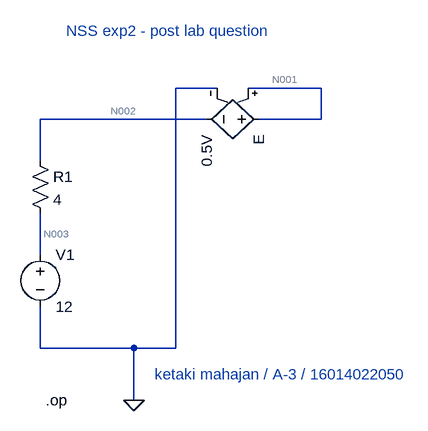
[diagram p0: schematic exp2_plq_16014022050.asc]
exp2_plq_16014022050.asc, the LTspice schematic file:
Version 4
SHEET 1 880 680
WIRE 336 -48 272 -48
WIRE 496 -48 384 -48
WIRE 320 0 64 0
WIRE 496 0 496 -48
WIRE 496 0 400 0
WIRE 64 64 64 0
WIRE 64 208 64 144
WIRE 64 352 64 288
WIRE 208 352 64 352
WIRE 272 352 272 -48
WIRE 272 352 208 352
WIRE 208 432 208 352
FLAG 208 432 0
SYMBOL res 48 48 R0
SYMATTR InstName R1
SYMATTR Value 4
SYMBOL voltage 64 192 R0
SYMATTR InstName V1
SYMATTR Value 12
SYMBOL e 416 0 R90
SYMATTR InstName E
SYMATTR Value 0.5V
TEXT 240 392 Left 2 ;ketaki mahajan / A-3 / 16014022050
TEXT 104 -136 Left 2 ;NSS exp2 - post lab question
TEXT 72 432 Left 2 !.op

The netlist it stands for:
* exp2_plq_16014022050.asc
R1 N002 N003 4
V1 N003 0 12
E N001 N002 N001 0 0.5V
* ketaki mahajan / A-3 / 16014022050
* NSS exp2 - post lab question
.op
.backanno
.end

* Results of the author's LTspice run, read from the files saved beside the schematic
* Operating Point:
*   V(n002) = 12 V
*   V(n003) = 12 V
*   V(n001) = 24 V
*   I(R1) = 0 A
*   I(E) = 0 A
*   I(V1) = 0 A